# EAGLE design Minimal_carrier_board_for_CM4_rev_E (EAGLE 9.6.2)
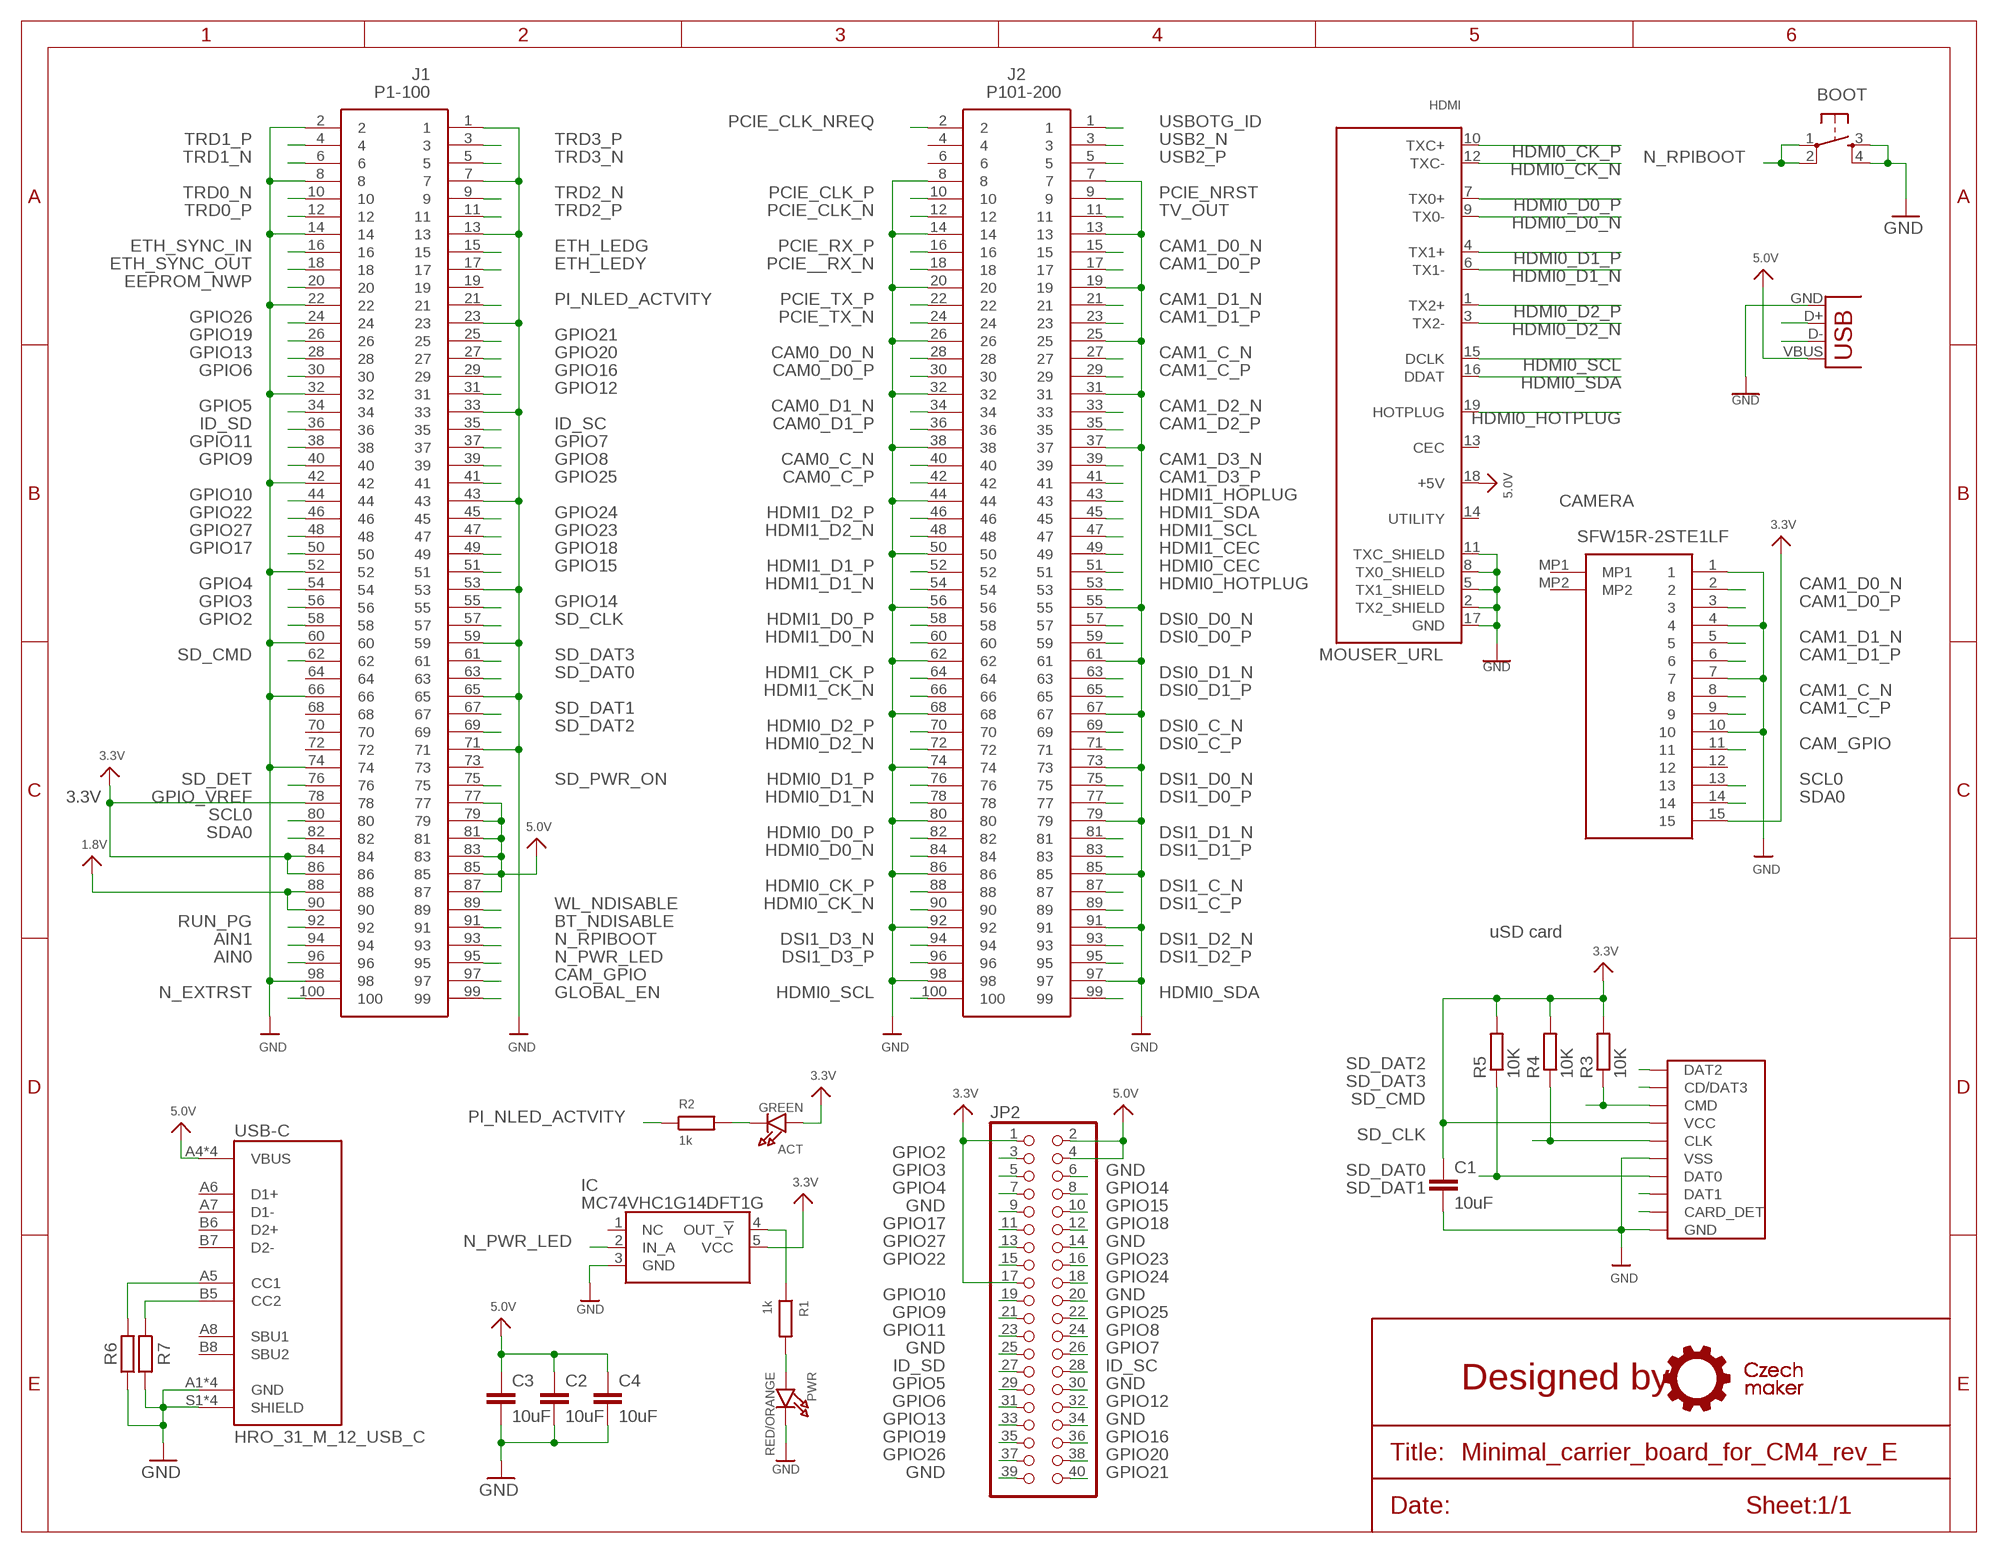
[diagram p0: schematic, sheet 1]

## Parts
ACT  GREEN  LED0805_NOOUTLINE  [CHIPLED_0805_NOOUTLINE]
BOOT  TACTILE_SWITCHE_5X5_MICRO_  [TACTILE_SWITCH_5X5_MICRO]
C1  10uF  C-EUC0805  [C0805]
C2  10uF  C-EUC0805  [C0805]
C3  10uF  C-EUC0805  [C0805]
C4  10uF  C-EUC0805  [C0805]
CAMERA  SFW15R-2STE1LF  [SFW15R2STE1LF]
HDMI  HDMI_MOLEX_47151-0001  [HDMI_MOLEX_47151-0001]
IC  MC74VHC1G14DFT1G  [SOT65P210X110-5N]
J1  P1-100  DF40C-100DS-0.4V_51_  [DF40C100DS04V51]
J2  P101-200  DF40C-100DS-0.4V_51_  [DF40C100DS04V51]
JP2  PINHD-2X20  [2X20]
PWR  RED/ORANGE  LED0805_NOOUTLINE  [CHIPLED_0805_NOOUTLINE]
R1  1k  R-EU_R0805  [R0805]
R2  1k  R-EU_R0805  [R0805]
R3  10K  R-EU_R0805  [R0805]
R4  10K  R-EU_R0805  [R0805]
R5  10K  R-EU_R0805  [R0805]
R6  5.1k  R-EU_R0805  [R0805]
R7  5.1k  R-EU_R0805  [R0805]
SD_CARD  MICRO_SD_CARD_  [TFP09-2--12B]
USB-A  USBA-PTH  [USB-A-F-PTH]
USB-C  HRO_31_M_12_USB_C  [HRO_31_M_12_USB_C]

## Nets
1.8V: J1.88 J1.90
3.3V: ACT.A C1.1 CAMERA.15 IC.5(VCC) J1.78 J1.84 J1.86 JP2.1 JP2.17 R3.2 R4.2 R5.2 SD_CARD.VCC
5.0V: C2.1 C3.1 C4.1 HDMI.18(+5V) J1.77 J1.79 J1.81 J1.83 J1.85 J1.87 JP2.2 JP2.4 USB-A.VBUS USB-C.A4(VBUS) USB-C.A9(VBUS) USB-C.B4(VBUS) USB-C.B9(VBUS)
AIN0: J1.96
AIN1: J1.94
BT_NDISABLE: J1.91
CAM0_C_N: J2.40
CAM0_C_P: J2.42
CAM0_D0_N: J2.28
CAM0_D0_P: J2.30
CAM0_D1_N: J2.34
CAM0_D1_P: J2.36
CAM1_C_N [diff_pairs]: CAMERA.8 J2.27
CAM1_C_P [diff_pairs]: CAMERA.9 J2.29
CAM1_D0_N [diff_pairs]: CAMERA.2 J2.15
CAM1_D0_P [diff_pairs]: CAMERA.3 J2.17
CAM1_D1_N [diff_pairs]: CAMERA.5 J2.21
CAM1_D1_P [diff_pairs]: CAMERA.6 J2.23
CAM1_D2_N [diff_pairs]: J2.33
CAM1_D2_P [diff_pairs]: J2.35
CAM1_D3_N [diff_pairs]: J2.39
CAM1_D3_P [diff_pairs]: J2.41
CAM_GPIO: CAMERA.11 J1.97
DSI0_C_N: J2.69
DSI0_C_P: J2.71
DSI0_D0_N: J2.57
DSI0_D0_P: J2.59
DSI0_D1_N: J2.63
DSI0_D1_P: J2.65
DSI1_C_N [diff_pairs]: J2.87
DSI1_C_P [diff_pairs]: J2.89
DSI1_D0_N [diff_pairs]: J2.75
DSI1_D0_P [diff_pairs]: J2.77
DSI1_D1_N [diff_pairs]: J2.81
DSI1_D1_P [diff_pairs]: J2.83
DSI1_D2_N [diff_pairs]: J2.93
DSI1_D2_P [diff_pairs]: J2.95
DSI1_D3_N [diff_pairs]: J2.94
DSI1_D3_P [diff_pairs]: J2.96
EEPROM_NWP: J1.20
ETH_LEDG: J1.15
ETH_LEDY: J1.17
ETH_SYNC_IN: J1.16
ETH_SYNC_OUT: J1.18
GLOBAL_EN: J1.99
GND: BOOT.3 BOOT.4 C1.2 C2.2 C3.2 C4.2 CAMERA.1 CAMERA.4 CAMERA.7 CAMERA.10 HDMI.2(TX2_SHIELD) HDMI.5(TX1_SHIELD) HDMI.8(TX0_SHIELD) HDMI.11(TXC_SHIELD) HDMI.17(GND) IC.3(GND) J1.1 J1.2 J1.7 J1.8 J1.13 J1.14 J1.22 J1.23 J1.32 J1.33 J1.42 J1.43 J1.52 J1.53 J1.59 J1.60 J1.65 J1.66 J1.71 J1.74 J1.98 J2.7 J2.8 J2.13 J2.14 J2.19 J2.20 J2.25 J2.26 J2.31 J2.32 J2.37 J2.38 J2.44 J2.50 J2.55 J2.56 J2.61 J2.62 J2.67 J2.68 J2.73 J2.74 J2.79 J2.80 J2.85 J2.86 J2.91 J2.92 J2.97 J2.98 JP2.6 JP2.9 JP2.14 JP2.20 JP2.25 JP2.30 JP2.34 JP2.39 PWR.C R6.1 R7.2 SD_CARD.GND SD_CARD.GND@1(GND) SD_CARD.GND@2(GND) SD_CARD.GND@3(VSS) SD_CARD.VSS(GND) USB-A.GND USB-C.A1(GND) USB-C.A12(GND) USB-C.B1(GND) USB-C.B12(GND) USB-C.S1(SHIELD) USB-C.S2(SHIELD) USB-C.S3(SHIELD) USB-C.S4(SHIELD)
GPIO2: J1.58 JP2.3
GPIO3: J1.56 JP2.5
GPIO4: J1.54 JP2.7
GPIO5: J1.34 JP2.29
GPIO6: J1.30 JP2.31
GPIO7: J1.37 JP2.26
GPIO8: J1.39 JP2.24
GPIO9: J1.40 JP2.21
GPIO10: J1.44 JP2.19
GPIO11: J1.38 JP2.23
GPIO12: J1.31 JP2.32
GPIO13: J1.28 JP2.33
GPIO14: J1.55 JP2.8
GPIO15: J1.51 JP2.10
GPIO16: J1.29 JP2.36
GPIO17: J1.50 JP2.11
GPIO18: J1.49 JP2.12
GPIO19: J1.26 JP2.35
GPIO20: J1.27 JP2.38
GPIO21: J1.25 JP2.40
GPIO22: J1.46 JP2.15
GPIO23: J1.47 JP2.16
GPIO24: J1.45 JP2.18
GPIO25: J1.41 JP2.22
GPIO26: J1.24 JP2.37
GPIO27: J1.48 JP2.13
HDMI0_CEC: J2.51
HDMI0_CK_N [diff_pairs]: HDMI.12(TXC-) J2.90
HDMI0_CK_P [diff_pairs]: HDMI.10(TXC+) J2.88
HDMI0_D0_N [diff_pairs]: HDMI.9(TX0-) J2.84
HDMI0_D0_P [diff_pairs]: HDMI.7(TX0+) J2.82
HDMI0_D1_N [diff_pairs]: HDMI.6(TX1-) J2.78
HDMI0_D1_P [diff_pairs]: HDMI.4(TX1+) J2.76
HDMI0_D2_N [diff_pairs]: HDMI.3(TX2-) J2.72
HDMI0_D2_P [diff_pairs]: HDMI.1(TX2+) J2.70
HDMI0_HOTPLUG: HDMI.19(HOTPLUG) J2.53
HDMI0_SCL: HDMI.15(DCLK) J2.100
HDMI0_SDA: HDMI.16(DDAT) J2.99
HDMI1_CEC: J2.49
HDMI1_CK_N: J2.66
HDMI1_CK_P: J2.64
HDMI1_D0_N: J2.60
HDMI1_D0_P: J2.58
HDMI1_D1_N: J2.54
HDMI1_D1_P: J2.52
HDMI1_D2_N: J2.48
HDMI1_D2_P: J2.46
HDMI1_HOPLUG: J2.43
HDMI1_SCL: J2.47
HDMI1_SDA: J2.45
ID_SC: J1.35 JP2.28
ID_SD: J1.36 JP2.27
N$1: ACT.C R2.2
N$8: PWR.A R1.2
N$9: SD_CARD.CD(CARD_DET)
N$14: R6.2 USB-C.A5(CC1)
N$15: R7.1 USB-C.B5(CC2)
N$16: IC.4(OUT_!Y) R1.1
N_EXTRST: J1.100
N_PWR_LED: IC.2(IN_A) J1.95
N_RPIBOOT: BOOT.1 BOOT.2 J1.93
PCIE__RX_N: J2.18
PCIE_CLK_N: J2.12
PCIE_CLK_NREQ: J2.2
PCIE_CLK_P: J2.10
PCIE_NRST: J2.9
PCIE_RX_P: J2.16
PCIE_TX_N: J2.24
PCIE_TX_P: J2.22
PI_NLED_ACTVITY: J1.21 R2.1
RUN_PG: J1.92
SCL0: CAMERA.13 J1.80
SD_CLK: J1.57 R4.1 SD_CARD.CLK
SD_CMD: J1.62 R3.1 SD_CARD.CMD
SD_DAT0: J1.63 R5.1 SD_CARD.DAT0
SD_DAT1: J1.67 SD_CARD.DAT1
SD_DAT2: J1.69 SD_CARD.DAT2
SD_DAT3: J1.61 SD_CARD.CD/DAT3
SD_DET: J1.76
SD_PWR_ON: J1.75
SDA0: CAMERA.14 J1.82
TRD0_N: J1.10
TRD0_P: J1.12
TRD1_N: J1.6
TRD1_P: J1.4
TRD2_N: J1.9
TRD2_P: J1.11
TRD3_N: J1.5
TRD3_P: J1.3
TV_OUT: J2.11
USB2_N [diff_pairs]: J2.3 USB-A.D-
USB2_P [diff_pairs]: J2.5 USB-A.D+
USBOTG_ID: J2.1
WL_NDISABLE: J1.89
Unconnected: CAMERA.12 CAMERA.MP1 CAMERA.MP2 HDMI.13(CEC) HDMI.14(UTILITY) IC.1(NC) J1.19 J1.64 J1.68 J1.70 J1.72 J1.73 J2.4 J2.6 USB-C.A6(D1+) USB-C.A7(D1-) USB-C.A8(SBU1) USB-C.B6(D2+) USB-C.B7(D2-) USB-C.B8(SBU2)

## Notes on the sheet
- GPIO_VREF
- uSD card

## Power pins joined to a net without a drawn wire
GND: HDMI.P$1(GND) HDMI.P$2(GND) HDMI.P$3(GND) HDMI.P$4(GND)

## Library data of the parts
ACT PWR = dronecz:LED: LED 0603 - 0603 Surface Mount Package 2mA: Green LED - Low Power (3.9mcd, 2ma, 1.7Vf) - Digikey: 475-2709-2-ND Orange LED - Low Power (9.8mcd, 2ma, 1.8Vf) - Digikey: 475-1194-2-ND Red LED - Low Power (5mcd, 2ma, 1.8Vf) - Digikey: 475-1195-2-ND Yellow LED - Low Power (7mcd, 2ma, 1.8Vf) - Digikey: 475-1196-2-ND 5mA: Blue LED - Low Power (17mcd, 5ma, 2.9Vf) - Digikey: LNJ937W8CRACT-ND 0805 - 0805 Surface Mount Package 2mA: Red LED (8.8mcd, 2mA, 1.8Vf, Clear) - Low Power [Digikey: 475-2510-1-ND] Green LED (5mcd, 2mA, 1.8Vf, Clear) - Low Power [Digikey: 475-2730-1-ND] Yellow LED (11.3mcd, 2mA, 1.8Vf, Clear) - Low Power [Digikey: 475-2555-1-ND] 20mA: Red LED (104mcd, 20mA, Diffused) - LS R976 [Digikey: 475-1278-6-ND] Red LED (12mcd, 20mA, 2.0Vf, Clear) - APT2012EC [Digikey: 754-1128-1-ND] Green LED (15mcd, 20mA, 2.2Vf, Clear) - APT2012GC [Digikey: 754-1131-1-ND] Orange LED (160mcd, 20mA, 2.1Vf, Clear) - APT2012SECK [Digikey: 754-1130-1-ND] 1206 - 1206 Surface Mount Package Green LED (26mcd, 20mA, Diffused) - LG N971 [Digikey: 475-1407-6-ND] Red LED (15mcd, 20mA, Diffused) - LH N974 [Digikey: 475-1416-6-ND]
BOOT = dronecz:TACTILE_SWITCHE_5X5_MICRO
C1-C4 = rcl:C-EU: CAPACITOR, European symbol; SPICEPREFIX: C
CAMERA = dronecz:SFW15R-2STE1LF: FFC & FPC Connectors 15P SIDE SMT ZIF UPPER CONTACT Source: Datasheet <https://cdn.amphenol-icc.com/media/wysiwyg/files/drawing/sfw12lf.pdf>; DESCRIPTION: FFC & FPC Connectors 15P SIDE SMT ZIF UPPER CONTACT; HEIGHT: 2.7mm; MANUFACTURER_NAME: Amphenol; MANUFACTURER_PART_NUMBER: SFW15R-2STE1LF; MOUSER_PART_NUMBER: 649-SFW15R-2STE1LF; MOUSER_PRICE-STOCK: https://www.mouser.co.uk/ProductDetail/Amphenol-FCI/SFW15R-2STE1LF/?qs=XRaITl65jnu3B148xsdn9A%3D%3D
HDMI = dronecz:HDMI_MOLEX_47151-0001; MOUSER_URL: https://cz.mouser.com/ProductDetail/Molex/47151-1081?qs=rg3U%2F5nEhHf8zd%2FI8aNW2A%3D%3D
IC = dronecz:MC74VHC1G14DFT1G: Source: Datasheet <http://www.onsemi.com/pub/Collateral/MC74VHC1G14-D.PDF>; HEIGHT: 1.1mm; MANUFACTURER_NAME: ON Semiconductor; MANUFACTURER_PART_NUMBER: MC74VHC1G14DFT1G; MOUSER_PART_NUMBER: 863-MC74VHC1G14DFT1G; MOUSER_PRICE-STOCK: https://www.mouser.co.uk/ProductDetail/ON-Semiconductor/MC74VHC1G14DFT1G?qs=YOLdObVcOZkl2BbCxsVnXA%3D%3D
J1 J2 = dronecz:DF40C-100DS-0.4V_51_: HIROSE(HRS) - DF40C-100DS-0.4V(51) - CONNECTOR, STACKING, RCPT, 100POS, 2ROW Source: Datasheet <https://www.hirose.com/product/en/download_file/key_name/DF40C-100DS-0.4V(51)/category/Drawing (2D)/doc_file_id/46856/?file_category_id=6&item_id=06844033451&is_series=>; DESCRIPTION: HIROSE(HRS) - DF40C-100DS-0.4V(51) - CONNECTOR, STACKING, RCPT, 100POS, 2ROW; HEIGHT: 1.65mm; MANUFACTURER_NAME: Hirose; MANUFACTURER_PART_NUMBER: DF40C-100DS-0.4V(51); MOUSER_PART_NUMBER: 798-DF40C100DS0.4V51; MOUSER_PRICE-STOCK: https://www.mouser.co.uk/ProductDetail/Hirose-Connector/DF40C-100DS-04V51?qs=eDUdFcBPps2MEwbnuPvZzQ%3D%3D
JP2 = pinhead:PINHD-2X20: PIN HEADER
R1-R7 = rcl:R-EU_: RESISTOR, European symbol; SPICEPREFIX: R
SD_CARD = dronecz:MICRO_SD_CARD
USB-A = Ai_Connectors:USB
USB-C = dronecz:HRO_31_M_12_USB_C: USB Shielded I/O Receptacle; Type C; Right Angle; Surface Mount; Gold over Nickel

## Net classes
1 diff_pairs: width 0.152 mm

## Board
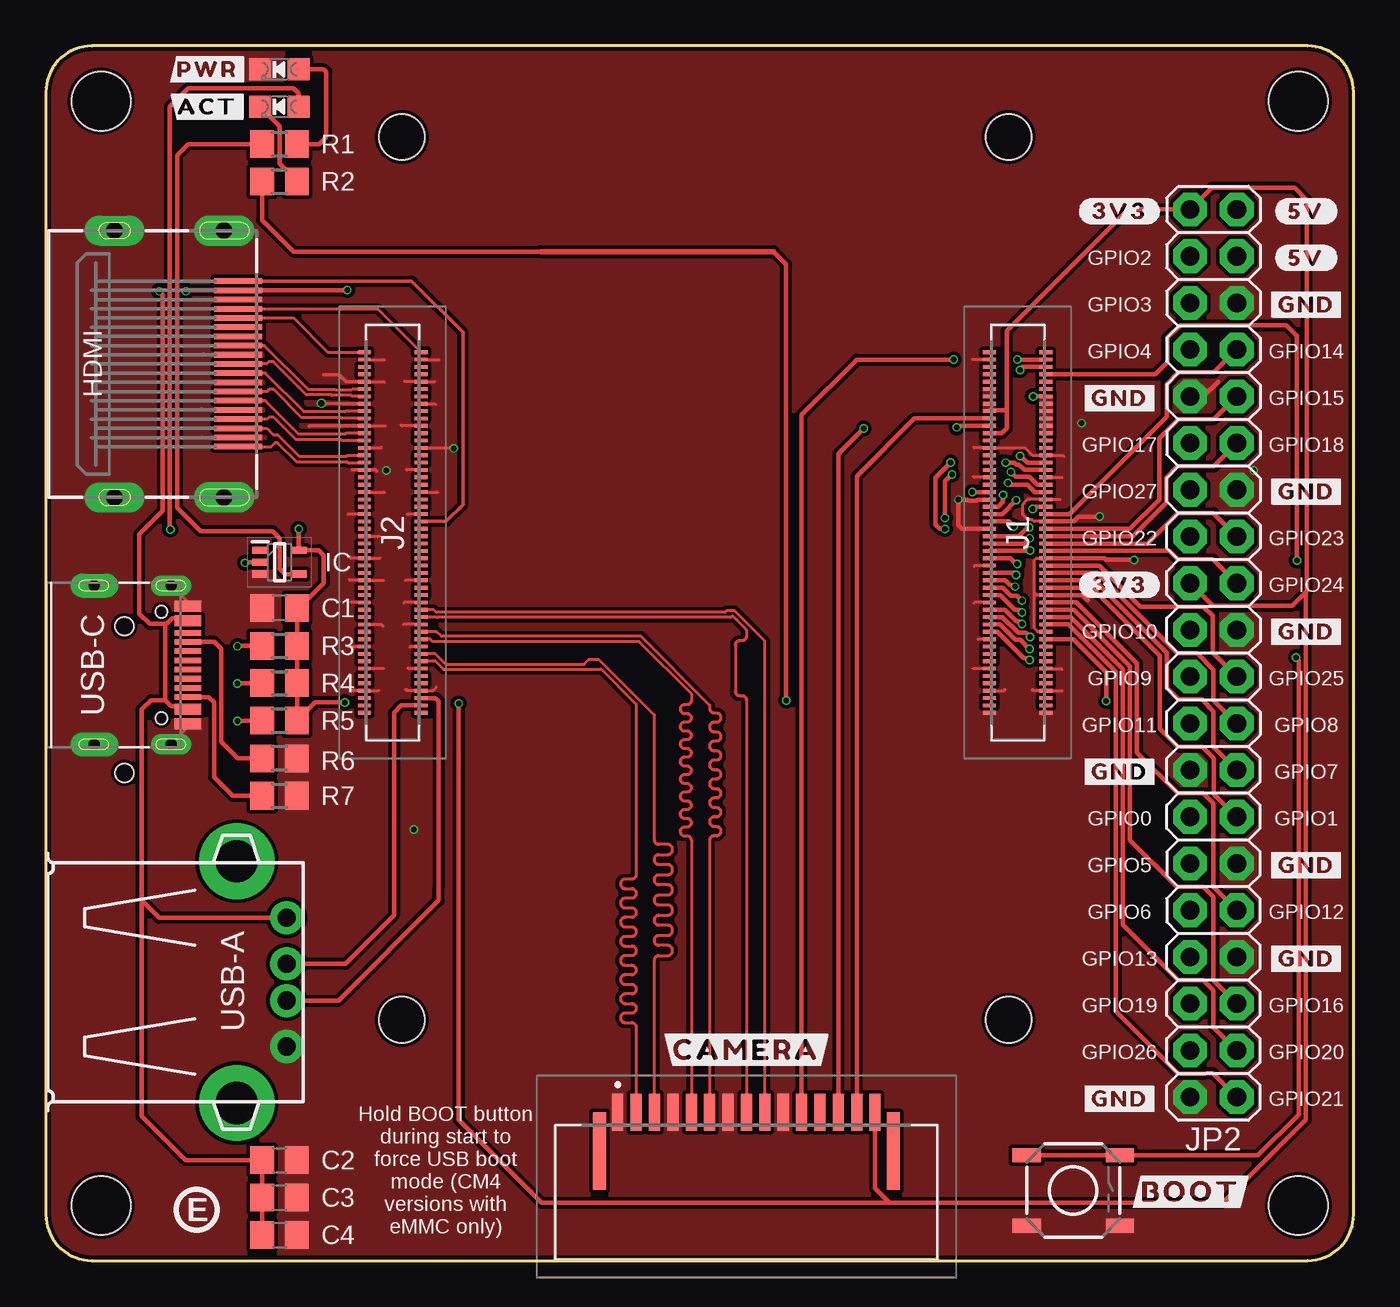
[diagram p1: board, top side]
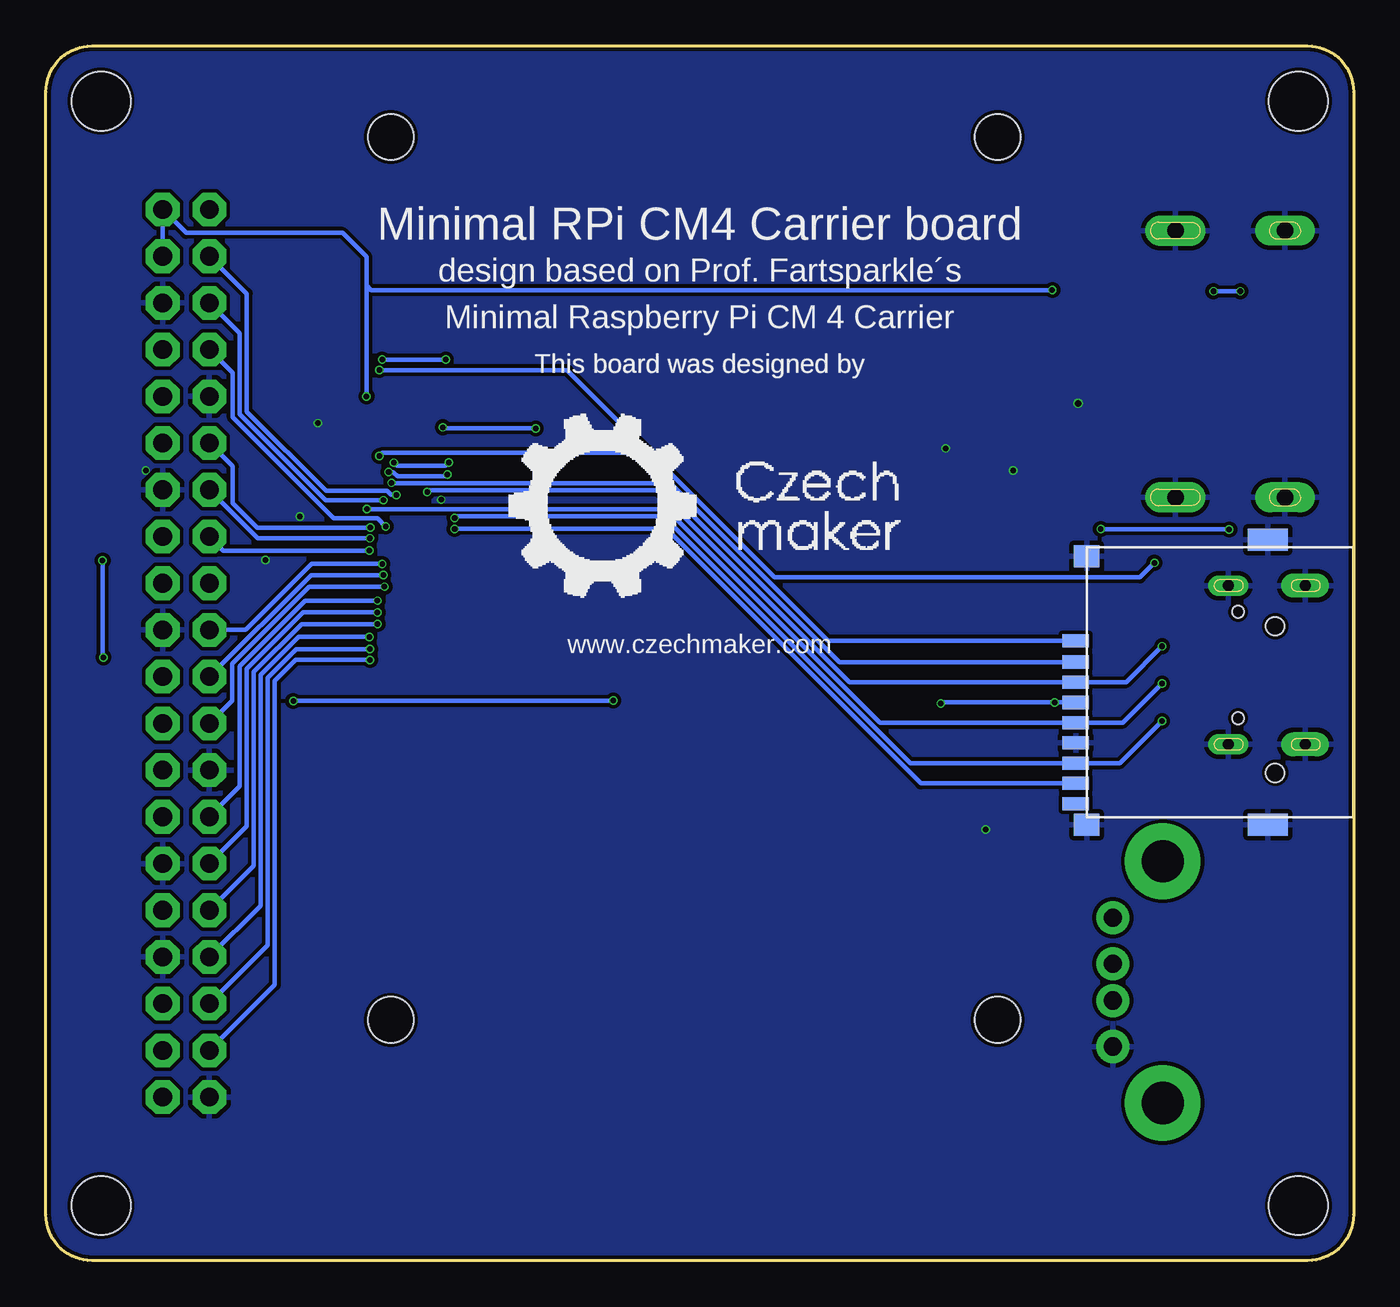
[diagram p2: board, bottom side, seen from below]

Size 71.12 x 66.04 mm. Coordinates in mm from the lower left corner, seen from the top.
Outline: 68.62,66.04 2.5,66.04 arc90 0,63.54 0,2.5 arc90 2.5,0 68.62,0 arc90 71.12,2.5 71.12,63.54 arc90 68.62,66.04
Copper layers (1*16): Top 0.035mm / dielectric 1.6mm / Bottom 0.035mm
Design rules "jlcpcb2layer": minimum track width 5mil, minimum drill 0.3mm, track to track 5mil, track to pad 5mil, pad to pad 5mil, via to via 5mil, smd to smd 5mil, copper to edge 0.2mm, drill to drill 6mil, minimum pad ring 10mil, minimum via ring 3mil, stop-mask expansion 4mil, vias tented up to drill 0mil, thermal gap 10mil
Holes 2.5 mm at 19.36,61.09 52.36,61.09 19.36,13.09 52.36,13.09
Holes 3.2 mm at 3,3 3,63.04 68.12,63.04 68.12,3

### Footprints (pad centres in the part's own frame; a part is rotated, then mirrored left to right if it is on the bottom)
CHIPLED_0805_NOOUTLINE = smd 1.2 x 1.2: A 0,-1.05; C 0,1.05
TACTILE_SWITCH_5X5_MICRO = smd 1.524 x 0.762: 1 -2.54,1.905; 2 2.54,1.905; 3 -2.54,-1.905; 4 2.54,-1.905
C0805 = smd 1.3 x 1.5: 1 -0.95,0; 2 0.95,0
SFW15R2STE1LF = smd 0.6 x 2: 1 -7,4; 2 -6,4; 3 -5,4; 4 -4,4; 5 -3,4; 6 -2,4; 7 -1,4; 8 0,4; 9 1,4; 10 2,4; 11 3,4; 12 4,4; 13 5,4; 14 6,4; 15 7,4 | smd 0.7 x 4.2: MP1 -8,1.9; MP2 8,1.9
HDMI_MOLEX_47151-0001 = smd 0.3 x 2.6: 1 4.5,0; 2 4,0; 3 3.5,0; 4 3,0; 5 2.5,0; 6 2,0; 7 1.5,0; 8 1,0; 9 0.5,0; 10 0,0; 11 -0.5,0; 12 -1,0; 13 -1.5,0; 14 -2,0; 15 -2.5,0; 16 -3,0; 17 -3.5,0; 18 -4,0; 19 -4.5,0 | drill 0.9 pad 1.65 long: P$1 -7.25,-0.76; P$2 7.25,-0.76 | drill 0.9 pad 1.5 long: P$3 7.25,-6.72; P$4 -7.25,-6.72
SOT65P210X110-5N = smd 0.85 x 0.4: 1 -1.05,0.65; 2 -1.05,0; 3 -1.05,-0.65; 4 1.05,-0.65; 5 1.05,0.65
DF40C100DS04V51 = smd 0.2 x 0.7: 1 -9.8,-1.54; 2 -9.8,1.54; 3 -9.4,-1.54; 4 -9.4,1.54; 5 -9,-1.54; 6 -9,1.54; 7 -8.6,-1.54; 8 -8.6,1.54; 9 -8.2,-1.54; 10 -8.2,1.54; 11 -7.8,-1.54; 12 -7.8,1.54; 13 -7.4,-1.54; 14 -7.4,1.54; 15 -7,-1.54; 16 -7,1.54; 17 -6.6,-1.54; 18 -6.6,1.54; 19 -6.2,-1.54; 20 -6.2,1.54; 21 -5.8,-1.54; 22 -5.8,1.54; 23 -5.4,-1.54; 24 -5.4,1.54; 25 -5,-1.54; 26 -5,1.54; 27 -4.6,-1.54; 28 -4.6,1.54; 29 -4.2,-1.54; 30 -4.2,1.54; 31 -3.8,-1.54; 32 -3.8,1.54; 33 -3.4,-1.54; 34 -3.4,1.54; 35 -3,-1.54; 36 -3,1.54; 37 -2.6,-1.54; 38 -2.6,1.54; 39 -2.2,-1.54; 40 -2.2,1.54; 41 -1.8,-1.54; 42 -1.8,1.54; 43 -1.4,-1.54; 44 -1.4,1.54; 45 -1,-1.54; 46 -1,1.54; 47 -0.6,-1.54; 48 -0.6,1.54; 49 -0.2,-1.54; 50 -0.2,1.54; 51 0.2,-1.54; 52 0.2,1.54; 53 0.6,-1.54; 54 0.6,1.54; 55 1,-1.54; 56 1,1.54; 57 1.4,-1.54; 58 1.4,1.54; 59 1.8,-1.54; 60 1.8,1.54; 61 2.2,-1.54; 62 2.2,1.54; 63 2.6,-1.54; 64 2.6,1.54; 65 3,-1.54; 66 3,1.54; 67 3.4,-1.54; 68 3.4,1.54; 69 3.8,-1.54; 70 3.8,1.54; 71 4.2,-1.54; 72 4.2,1.54; 73 4.6,-1.54; 74 4.6,1.54; 75 5,-1.54; 76 5,1.54; 77 5.4,-1.54; 78 5.4,1.54; 79 5.8,-1.54; 80 5.8,1.54; 81 6.2,-1.54; 82 6.2,1.54; 83 6.6,-1.54; 84 6.6,1.54; 85 7,-1.54; 86 7,1.54; 87 7.4,-1.54; 88 7.4,1.54; 89 7.8,-1.54; 90 7.8,1.54; 91 8.2,-1.54; 92 8.2,1.54; 93 8.6,-1.54; 94 8.6,1.54; 95 9,-1.54; 96 9,1.54; 97 9.4,-1.54; 98 9.4,1.54; 99 9.8,-1.54; 100 9.8,1.54
2X20 = drill 1.016 octagon: 1 -24.13,-1.27; 2 -24.13,1.27; 3 -21.59,-1.27; 4 -21.59,1.27; 5 -19.05,-1.27; 6 -19.05,1.27; 7 -16.51,-1.27; 8 -16.51,1.27; 9 -13.97,-1.27; 10 -13.97,1.27; 11 -11.43,-1.27; 12 -11.43,1.27; 13 -8.89,-1.27; 14 -8.89,1.27; 15 -6.35,-1.27; 16 -6.35,1.27; 17 -3.81,-1.27; 18 -3.81,1.27; 19 -1.27,-1.27; 20 -1.27,1.27; 21 1.27,-1.27; 22 1.27,1.27; 23 3.81,-1.27; 24 3.81,1.27; 25 6.35,-1.27; 26 6.35,1.27; 27 8.89,-1.27; 28 8.89,1.27; 29 11.43,-1.27; 30 11.43,1.27; 31 13.97,-1.27; 32 13.97,1.27; 33 16.51,-1.27; 34 16.51,1.27; 35 19.05,-1.27; 36 19.05,1.27; 37 21.59,-1.27; 38 21.59,1.27; 39 24.13,-1.27; 40 24.13,1.27
R0805 = smd 1.3 x 1.5: 1 -0.95,0; 2 0.95,0
TFP09-2--12B = smd 0.711 x 1.422: CD -6.6,7.85; CD/DAT3 1.1,7.85; CLK -2.2,7.85; CMD 0,7.85; DAT0 -4.4,7.85; DAT1 -5.5,7.85; DAT2 2.25,7.85; VCC -1.1,7.85; VSS -3.3,7.85 | smd 1.2 x 2.2: GND -7.75,-2.6; GND@1 7.75,-2.6 | smd 1.2 x 1.4: GND@2 -7.75,7.25; GND@3 6.85,7.25 | hole 1: -4.93,-3; 3.05,-3
USB-A-F-PTH = drill 1: D+ 1,5.37; D- -1,5.37; GND 3.5,5.37; VBUS -3.5,5.37 | drill 2.286: P$1 -6.57,2.66; P$2 6.57,2.66
HRO_31_M_12_USB_C = smd 0.3 x 1.45: A1 -3.35,4.045; A4 -2.55,4.045; A5 -1.25,4.045; A6 -0.25,4.045; A7 0.25,4.045; A8 1.25,4.045; A9 2.55,4.045; A12 3.35,4.045; B1 3.05,4.045; B4 2.25,4.045; B5 1.75,4.045; B6 0.75,4.045; B7 -0.75,4.045; B8 -1.75,4.045; B9 -2.25,4.045; B12 -3.05,4.045 | drill 0.6 pad 1.1 long: S1 -4.32,3.13; S2 4.32,3.13 | drill 0.6 pad 1.3 long: S3 -4.32,-1.05; S4 4.32,-1.05 | hole 0.65: -2.89,2.6; 2.89,2.6

### Placement (x,y rotation side)
ACT  12.7,62.74 90 top
BOOT  55.88,3.81 0 top
C1  12.7,35.48 180 top
C2  12.7,5.46 0 top
C3  12.7,3.43 0 top
C4  12.7,1.4 0 top
CAMERA  38.1,4.06 0 top
HDMI  10.45,48.75 270 top
IC  12.7,37.97 0 top
J1  52.86,39.59 90 top
J2  18.86,39.59 90 top
JP2  63.5,33.02 270 top
PWR  12.7,64.77 90 top
R1  12.7,60.71 0 top
R2  12.7,58.67 0 top
R3  12.7,33.43 0 top
R4  12.7,31.39 0 top
R5  12.7,29.36 0 top
R6  12.7,27.3 180 top
R7  12.7,25.27 0 top
SD_CARD  7.26,31.45 90 bottom
U$6  [#GND#0]  68.55,51.97 0 top
U$7  [#GND#0]  58.39,46.89 0 top
U$8  [#GND#0]  68.55,41.81 0 top
U$9  [#GND#0]  68.55,34.19 0 top
U$10  [#GND#0]  58.39,26.57 0 top
U$11  [#GND#0]  68.55,21.49 0 top
U$12  [#GND#0]  68.55,16.41 0 top
U$13  [#GND#0]  58.39,8.79 0 top
U$14  [#5V#0]  68.55,57.05 0 top
U$15  [#5V#0]  68.55,54.51 0 top
U$16  [#3V3#0]  58.39,57.05 0 top
U$17  [#3V3#0]  58.39,36.73 0 top
U$18  [#PWR#0]  8.76,64.77 0 top
U$19  [#ACT#0]  8.76,62.74 0 top
U$20  [#CAMERA#0]  38.1,11.46 0 top
U$21  [#BOOT#0]  62.26,3.75 0 top
USB-A  7.72,15.14 270 top
USB-C  3.68,32.38 270 top

### Tracks (layer width: path | path; a pad name or v marks a point on that pad's centre or on a via)
1.8V
  pour Top (no thermals): 50.99,46.93 50.99,47.47 51.63,47.47 51.63,46.93
3.3V  (via drill 0.3)
  Top 0.152: J1.84 51.36,46.23
  Top 0.254: ACT.A 13.75,63.47 13.46,63.75 7.75,63.75 6.73,62.74 6.73,39.78 v6.76,39.75 | v16.26,30.35 14.64,30.35 R5.2 R4.2 R3.2 C1.1 13.77,35.48 15.11,36.83 15.11,38.35 14.84,38.62 IC.5 v13.75,39.78 | 52.26,46.23 52.26,50.55 58.86,57.15 JP2.1 63.41,58.32 67.91,58.32 68.58,57.66 68.58,36.38 68.53,36.34 | JP2.17 63.47,35.59 67.79,35.59 68.53,36.34 | CAMERA.15 45.1,3.92 45.88,3.14 | 45.88,3.14 64.01,3.14 68.53,7.67 68.53,36.34 | v22.45,30.29 22.45,7.65 26.96,3.14 45.88,3.14 | J1.78 52,44.99 52.26,45.24 52.26,46.23 | 51.36,46.23 52.26,46.23
  Bottom 0.254: SD_CARD.VCC 15.12,30.35 v16.26,30.35 22.38,30.35 v22.45,30.29 | v6.76,39.75 13.72,39.75 v13.75,39.78
  pour Top (no thermals): 50.99,46.13 50.99,46.64 51.63,46.64 51.63,46.13
5.0V  (via drill 0.3)
  Top 0.152: USB-C.B9 USB-C.A4 | USB-C.A9 USB-C.B4
  Top 0.254: v7.62,52.7 7.67,52.75 HDMI.18 16.37,52.75 v16.38,52.77 | v6.16,52.7 6.35,52.52 6.35,40.77 5.08,39.5 5.08,35.18 5.64,34.62 6.48,34.62 | USB-C.A4 6.87,34.94 6.55,34.62 6.48,34.62 | USB-C.B4 6.82,30.14 6.48,30.48 | 6.48,30.48 6.48,34.62 | USB-A.VBUS 6.16,18.64 5.21,19.59 | 6.48,30.48 5.71,30.48 5.21,29.97 5.21,19.59 | J1.87 v53.69,46.99 | C4.1 C3.1 C2.1 7.59,5.46 5.21,7.84 5.21,19.59
  Bottom 0.254: v7.62,52.7 v6.16,52.7 | v53.69,46.99 53.69,53.02 | 53.69,53.02 53.69,54.58 54.99,55.88 63.5,55.88 JP2.2 JP2.4 | v16.38,52.77 53.44,52.77 53.69,53.02
  pour Top (no thermals): 54.07,47.05 54.07,44.93 54.74,44.93 54.74,47.05
CAM1_C_N
  Top 0.152: CAMERA.8 38.1,30.48 arc90 37.87,30.71 37.73,30.71 arc-90 37.49,30.95 37.49,33.47 arc-90 37.73,33.7 37.87,33.7 arc90 38.1,33.94 38.1,34.29 37.34,35.05 37.26,34.97 21.3,34.97 20.42,34.97 J2.27
CAM1_C_P
  Top 0.152: CAMERA.9 39.1,33.69 37.45,35.33 37.01,35.33 36.93,35.25 21.23,35.25 21.09,35.39 J2.29
CAM1_D0_N
  Top 0.152: CAMERA.2 32.1,12.7 arc90 31.86,12.94 31.5,12.94 arc-90 31.26,13.17 31.26,13.22 arc-90 31.5,13.46 31.86,13.46 arc90 32.1,13.69 32.1,13.74 arc90 31.86,13.98 31.5,13.98 arc-90 31.26,14.21 31.26,14.26 arc-90 31.5,14.5 31.86,14.5 arc90 32.1,14.73 32.1,14.78 arc90 31.86,15.02 31.5,15.02 arc-90 31.26,15.25 31.26,15.3 arc-90 31.5,15.54 31.86,15.54 arc90 32.1,15.77 32.1,15.82 arc90 31.86,16.06 31.5,16.06 arc-90 31.26,16.29 31.26,16.34 arc-90 31.5,16.58 31.86,16.58 arc90 32.1,16.81 32.1,16.86 arc90 31.86,17.1 31.5,17.1 arc-90 31.26,17.33 31.26,17.39 arc-90 31.5,17.62 31.86,17.62 arc90 32.1,17.86 32.1,17.91 arc90 31.86,18.14 31.5,18.14 arc-90 31.26,18.38 31.26,18.43 arc-90 31.5,18.66 31.86,18.66 arc90 32.1,18.9 32.1,18.95 arc90 31.86,19.18 31.5,19.18 arc-90 31.26,19.42 31.26,19.47 arc-90 31.5,19.7 31.86,19.7 arc90 32.1,19.94 32.1,19.99 arc90 31.86,20.22 31.5,20.22 arc-90 31.26,20.46 31.26,20.51 arc-90 31.5,20.74 31.86,20.74 arc90 32.1,20.98 32.1,30.26 30.19,32.17 30.18,32.16 30.16,32.14 21.62,32.14 21.16,32.6 21.13,32.6 21.12,32.59 J2.15
CAM1_D0_P
  Top 0.152: CAMERA.3 33.1,16.35 arc-90 33.34,16.58 33.84,16.58 arc90 34.07,16.82 34.07,16.9 arc90 33.84,17.13 33.34,17.13 arc-90 33.1,17.37 33.1,17.45 arc-90 33.34,17.68 33.84,17.68 arc90 34.07,17.92 34.07,18 arc90 33.84,18.23 33.34,18.23 arc-90 33.1,18.47 33.1,18.55 arc-90 33.34,18.78 33.84,18.78 arc90 34.07,19.02 34.07,19.09 arc90 33.84,19.33 33.34,19.33 arc-90 33.1,19.57 33.1,19.64 arc-90 33.34,19.88 33.84,19.88 arc90 34.07,20.11 34.07,20.19 arc90 33.84,20.43 33.34,20.43 arc-90 33.1,20.66 33.1,20.74 arc-90 33.34,20.98 33.84,20.98 arc90 34.07,21.21 34.07,21.29 arc90 33.84,21.53 33.34,21.53 arc-90 33.1,21.76 33.1,21.84 arc-90 33.34,22.08 33.84,22.08 arc90 34.07,22.31 34.07,22.39 arc90 33.84,22.62 33.34,22.62 arc-90 33.1,22.86 33.1,29.65 30.09,32.66 29.51,32.66 29.27,32.42 21.74,32.42 21.18,32.99 J2.17
CAM1_D1_N
  Top 0.152: CAMERA.5 35.1,22.86 arc90 34.87,23.09 34.73,23.09 arc-90 34.5,23.33 34.5,23.34 arc-90 34.73,23.57 34.87,23.57 arc90 35.1,23.8 35.1,23.81 arc90 34.87,24.05 34.73,24.05 arc-90 34.5,24.28 34.5,24.29 arc-90 34.73,24.52 34.87,24.52 arc90 35.1,24.76 35.1,24.76 arc90 34.87,25 34.73,25 arc-90 34.5,25.23 34.5,25.24 arc-90 34.73,25.47 34.87,25.47 arc90 35.1,25.71 35.1,25.71 arc90 34.87,25.95 34.73,25.95 arc-90 34.5,26.18 34.5,26.19 arc-90 34.73,26.42 34.87,26.42 arc90 35.1,26.66 35.1,26.66 arc90 34.87,26.9 34.73,26.9 arc-90 34.5,27.13 34.5,27.14 arc-90 34.73,27.37 34.87,27.37 arc90 35.1,27.61 35.1,27.61 arc90 34.87,27.85 34.73,27.85 arc-90 34.5,28.08 34.5,28.09 arc-90 34.73,28.32 34.87,28.32 arc90 35.1,28.56 35.1,28.56 arc90 34.87,28.8 34.73,28.8 arc-90 34.5,29.03 34.5,29.04 arc-90 34.73,29.27 34.87,29.27 arc90 35.1,29.51 35.1,29.51 arc90 34.87,29.75 34.73,29.75 arc-90 34.5,29.98 34.5,29.99 arc-90 34.73,30.22 34.87,30.22 arc90 35.1,30.46 35.1,30.81 32.26,33.66 21.03,33.66 20.9,33.79 J2.21
CAM1_D1_P
  Top 0.152: CAMERA.6 36.1,22.86 arc-90 36.34,23.09 36.47,23.09 arc90 36.7,23.33 36.7,23.37 arc90 36.47,23.61 36.34,23.61 arc-90 36.1,23.84 36.1,23.89 arc-90 36.34,24.12 36.47,24.12 arc90 36.7,24.36 36.7,24.4 arc90 36.47,24.64 36.34,24.64 arc-90 36.1,24.87 36.1,24.92 arc-90 36.34,25.15 36.47,25.15 arc90 36.7,25.39 36.7,25.43 arc90 36.47,25.67 36.34,25.67 arc-90 36.1,25.9 36.1,25.95 arc-90 36.34,26.18 36.47,26.18 arc90 36.7,26.42 36.7,26.46 arc90 36.47,26.7 36.34,26.7 arc-90 36.1,26.93 36.1,26.98 arc-90 36.34,27.21 36.47,27.21 arc90 36.7,27.45 36.7,27.49 arc90 36.47,27.72 36.34,27.72 arc-90 36.1,27.96 36.1,28 arc-90 36.34,28.24 36.47,28.24 arc90 36.7,28.47 36.7,28.52 arc90 36.47,28.75 36.34,28.75 arc-90 36.1,28.99 36.1,29.03 arc-90 36.34,29.27 36.47,29.27 arc90 36.7,29.5 36.7,29.55 arc90 36.47,29.78 36.34,29.78 arc-90 36.1,30.02 36.1,30.21 32.37,33.93 21.51,33.93 21.26,34.19 J2.23
CAM_GPIO  (via drill 0.3)
  Top 0.254: CAMERA.11 41.1,45.99 44.1,48.99 v49.37,48.99 | v52.83,48.99 J1.97
  Bottom 0.254: v49.37,48.99 v52.83,48.99
GND  (via drill 0.3, 0.35)
  Top 0.152: J2.92 18.38,47.79 18.41,47.75 | 21.14,47.78 21.14,47.79 J2.91 19.52,47.79 19.49,47.82 | J2.80 18.43,45.39 18.45,45.37 | J2.74 18.21,44.19 18.26,44.23 | J2.62 18.38,41.79 18.41,41.75 | J2.56 17.3,40.58 16.41,40.58 | J2.50 18.11,39.39 18.13,39.37 | 18.35,36.99 J2.38 16.54,36.99 16.51,37.02 | J2.32 16.63,35.79 16.61,35.81 | J2.26 18.25,34.59 18.32,34.51 | J2.20 16.43,33.39 16.41,33.4 | J2.14 18.38,32.2 | 16.61,30.99 J2.8 18.1,30.99 | 21.24,31.18 21.05,30.99 J2.7 19.62,30.99 19.56,31.05 | J2.13 19.72,32.19 19.68,32.23 | J2.19 19.8,33.39 19.78,33.37 | J2.25 19.44,34.59 19.43,34.58 | J2.31 19.5,35.79 19.46,35.75 | J2.37 19.56,36.99 | J2.55 19.66,40.59 19.65,40.58 | J2.61 21.27,41.79 21.3,41.75 | J2.67 19.62,42.99 19.59,43.02 | J2.73 22.17,44.19 v22.19,44.16 | J2.79 19.35,45.39 19.3,45.43 | J2.85 21.17,46.59 21.21,46.54 | J2.97 21.34,48.99 21.37,48.96 | J2.86 15.01,46.59 v14.99,46.61 | J2.98 18.39,48.99 18.41,48.96 | USB-C.S2 6.81,28.12 USB-C.A12 | USB-C.S1 7.73,35.79 USB-C.A1 | J1.8 52.1,30.99 52.16,31.05 | J1.14 50.43,32.19 50.42,32.2 | J1.22 50.71,33.79 50.7,33.78 | J1.32 50.52,35.79 50.48,35.75 | J1.42 50.52,37.79 50.48,37.75 | 50.45,44.23 50.49,44.19 J1.74 53.25,44.19 53.66,43.78 J1.71 55.3,43.79 55.37,43.72 | J1.65 55.27,42.59 55.28,42.58 | J1.33 53.89,36.19 53.77,36.31 | 53.77,36.31 53.75,36.32 53.75,38.07 53.88,38.2 54.39,38.2 J1.43 | J1.23 53.95,34.19 53.77,34.37 53.77,36.31 | J1.13 55.22,32.19 55.28,32.13 | 53.63,31.05 53.69,30.99 J1.7 55.25,30.99 55.28,30.96 | J1.66 50.47,42.59 50.42,42.64 | J1.53 53.75,40.19 53.65,40.29 53.4,40.29 53.12,40.58 53.12,41.08 53.2,41.16 53.2,41.21 53.37,41.39 J1.59 55.13,41.39 55.15,41.37
  Top 0.152: J1.98 50.39,48.99 | HDMI.2 8.49,44.75 8.48,44.77 | HDMI.5 8.52,46.25 8.45,46.32 | HDMI.8 8.48,47.75 8.45,47.78 | HDMI.11 8.63,49.25 8.57,49.31 | HDMI.17 8.61,52.25 8.57,52.29 | 16.51,38.26 16.58,38.19 J2.44 18.16,38.2
  Top 0.203: 17.98,42.93 17.92,42.99 J2.68 16.65,42.99 | J2.80 14.35,45.39 14.33,45.36 | J2.86 16.15,46.59 | J2.92 16.32,47.79 15.95,48.16 15.11,48.16
  Top 0.254: J1.53 55.9,40.19 56.17,40.45 v57.31,40.45 | J1.43 57.57,38.19 57.66,38.1 v59.18,38.1 | J1.33 56.4,36.19 56.67,35.91 | J1.60 51.3,41.37 50.65,41.37 50.59,41.3 50.19,41.3 50.12,41.37 | 50.12,41.37 v49.62,41.37 49.62,39.97 49.81,39.79 J1.52 | 50.09,41.34 50.12,41.37 | JP2.9 62.96,46.99 63.75,47.78
  other vias: 20,23.43 18.51,42.96 56.32,45.53 65.69,42.96
  pour Top (isolate 0.203, rank 2, no thermals): -1.92,67.86 73.44,67.86 73.44,-1.69 -1.92,-1.69
  pour Bottom (isolate 0.203, rank 2): -4.21,70.4 74.58,70.4 74.58,-2.58 -4.21,-2.58
GPIO2  (via drill 0.3)
  Top 0.254: J1.58 51.8,40.99 52.06,41.25 v52.06,41.63
  Bottom 0.254: v52.06,41.63 52.34,41.63 52.56,41.85 55.88,41.85 60.2,46.16 60.2,52.58 JP2.3
GPIO3  (via drill 0.3)
  Top 0.254: J1.56 52.01,40.59 v52.77,41.34
  Bottom 0.254: v52.77,41.34 55.92,41.34 60.58,46 60.58,50.42 JP2.5
GPIO4  (via drill 0.3)
  Top 0.254: J1.54 52.36,40.19 v52.64,39.91
  Bottom 0.254: v52.64,39.91 53.09,40.35 55.47,40.35 60.96,45.85 60.96,48.26 JP2.7
GPIO5  (via drill 0.3)
  Top 0.254: J1.34 51.91,36.19 52.7,35.4 52.93,35.4 v53.09,35.24
  Bottom 0.254: v53.09,35.24 57.12,35.24 60.2,32.17 60.2,23.62 JP2.29
GPIO6  (via drill 0.3)
  Top 0.254: J1.30 52.17,35.39 52.8,34.76 52.93,34.76 v53.09,34.61
  Bottom 0.254: v53.09,34.61 57.22,34.61 59.82,32.01 59.82,21.46 JP2.31
GPIO7
  Top 0.254: J1.37 57.03,36.99 60.96,33.05 60.96,31.15 61.59,30.51 62.87,30.51 63.5,29.88 63.5,27.94 JP2.26
GPIO8
  Top 0.254: J1.39 57.16,37.39 61.53,33.02 62.61,33.02 63.5,32.13 63.5,30.48 JP2.24
GPIO9  (via drill 0.3)
  Top 0.254: J1.40 52.66,37.39 v52.77,37.27
  Bottom 0.254: v52.77,37.27 56.71,37.27 JP2.21
GPIO10  (via drill 0.3)
  Top 0.254: J1.44 52.46,38.19 52.77,37.88 v52.83,37.88
  Bottom 0.254: v52.83,37.88 56.67,37.88 60.26,34.29 JP2.19
GPIO11  (via drill 0.3)
  Top 0.254: J1.38 52.19,36.99 52.44,36.73 52.61,36.73 v52.7,36.64
  Bottom 0.254: v52.7,36.64 56.8,36.64 60.99,32.45 60.99,30.45 JP2.23
GPIO12
  Top 0.254: J1.31 56.03,35.79 59.34,32.48 59.34,27.62 61.56,25.4 62.96,25.4 63.5,24.86 63.5,20.32 JP2.32
GPIO13  (via drill 0.3)
  Top 0.254: v53.53,33.91 53.31,34.13 52.89,34.13 52.03,34.99 J1.28
  Bottom 0.254: v53.53,33.91 57.38,33.91 59.44,31.85 59.44,19.3 JP2.33
GPIO14
  Top 0.254: J1.55 55.67,40.59 60.96,45.88 60.96,47.66 61.59,48.29 63.53,48.29 JP2.8
GPIO15
  Top 0.254: J1.51 58.97,39.79 60.55,41.37 60.55,44.7 61.59,45.75 63.53,45.75 JP2.10
GPIO16
  Top 0.254: J1.29 55.9,35.39 58.96,32.32 58.96,22.86 61.5,20.32 62.96,20.32 63.5,19.78 63.5,15.24 JP2.36
GPIO17  (via drill 0.3)
  Top 0.254: v53.47,39.86 53.37,39.76 53.3,39.76 52.93,39.39 J1.50
  Bottom 0.254: v53.47,39.86 59.64,39.86 60.96,41.18 60.96,43.18 JP2.11
GPIO18
  Top 0.254: J1.49 59.1,39.39 60.93,41.21 60.93,42.58 61.53,43.18 63.53,43.18 64.77,44.42 JP2.12
GPIO19  (via drill 0.3)
  Top 0.254: J1.26 51.89,34.59 52.73,33.75 52.99,33.75 v53.5,33.24
  Bottom 0.254: v53.5,33.24 57.51,33.24 59.05,31.69 59.05,17.14 JP2.35
GPIO20
  Top 0.254: J1.27 55.76,34.99 58.58,32.16 58.58,18.26 61.59,15.24 62.96,15.24 63.5,14.7 63.5,12.7 JP2.38
GPIO21
  Top 0.254: J1.25 55.62,34.59 58.2,32.01 58.2,13.56 61.59,10.16 63.09,10.16 63.12,10.19 63.47,10.19 JP2.40
GPIO22  (via drill 0.3)
  Top 0.254: J1.46 53.51,38.59 v53.53,38.61
  Bottom 0.254: v53.53,38.61 61.47,38.61 JP2.15
GPIO23
  Top 0.254: J1.47 59.91,38.99 61.56,40.64 63.5,40.64 JP2.16
GPIO24
  Top 0.254: J1.45 61.11,38.59 61.56,38.13 63.47,38.13 JP2.18
GPIO25
  Top 0.254: J1.41 57.3,37.79 59.53,35.56 62.96,35.56 63.47,35.05 63.47,33.05 JP2.22
GPIO26  (via drill 0.3)
  Top 0.254: J1.24 51.75,34.19 53.18,32.76 53.4,32.76 v53.5,32.66
  Bottom 0.254: v53.5,32.66 57.55,32.66 58.67,31.53 58.67,14.99 JP2.37
GPIO27  (via drill 0.3)
  Top 0.254: J1.48 53.21,38.99 v53.5,39.27
  Bottom 0.254: v53.5,39.27 59.59,39.27 JP2.13
HDMI0_CK_N
  Top 0.152: J2.90 16.66,47.39 16.6,47.33 15.75,47.33 15.72,47.35 14.28,47.35 11.88,49.75 HDMI.12
HDMI0_CK_P
  Top 0.152: J2.88 16.66,46.99 16.6,47.05 15.54,47.05 15.51,47.07 14.16,47.07 12.36,48.87 12.12,48.87 12,48.75 HDMI.10
HDMI0_D0_N
  Top 0.152: HDMI.9 11.92,48.25 14.04,46.14 16.27,46.14 16.32,46.19 J2.84
HDMI0_D0_P
  Top 0.152: HDMI.7 12.04,47.25 12.15,47.36 12.38,47.36 13.91,45.84 16.04,45.84 16.09,45.79 J2.82
HDMI0_D1_N
  Top 0.152: HDMI.6 11.92,46.75 13.73,44.94 16.27,44.94 16.32,44.99 J2.78
HDMI0_D1_P
  Top 0.152: HDMI.4 12.04,45.75 12.15,45.86 12.38,45.86 13.61,44.63 16.04,44.63 16.09,44.59 J2.76
HDMI0_D2_N
  Top 0.152: J2.72 16.4,43.79 16.35,43.74 13.76,43.74 12.59,44.9 12.37,44.9 12.02,45.25 HDMI.3
HDMI0_D2_P
  Top 0.152: J2.70 16.41,43.39 16.36,43.43 13.63,43.43 12.59,44.48 12.48,44.48 12.25,44.25 HDMI.1
HDMI0_HOTPLUG
  Top 0.203: HDMI.19 19.9,53.25 22.68,50.47 22.68,41.1 21.77,40.19 J2.53
HDMI0_SCL
  Top 0.152: HDMI.15 13.47,51.25 15.33,49.39 J2.100
HDMI0_SDA
  Top 0.152: HDMI.16 18.03,51.75 J2.99
ID_SC
  Top 0.254: J1.35 56.89,36.59 60.58,32.89 60.58,28.92 61.56,27.94 62.9,27.94 63.53,27.3 63.53,25.37 JP2.28
ID_SD  (via drill 0.3)
  Top 0.254: J1.36 52.05,36.59 52.48,36.16 52.8,36.16 v53.09,35.88
  Bottom 0.254: v53.09,35.88 57.02,35.88 60.58,32.32 60.58,25.78 JP2.27
N$1
  Top 0.254: R2.2 12.7,59.62 12.7,61.69 ACT.C
N$8
  Top 0.254: R1.2 14.86,60.71 15.24,61.09 15.24,64.64 15.11,64.77 PWR.A
N$14
  Top 0.254: R6.2 10.42,27.3 9.53,28.2 9.53,33.27 9.14,33.66 7.75,33.66 USB-C.A5
N$15
  Top 0.254: USB-C.B5 8.86,30.64 9.14,30.35 9.14,26.29 10.16,25.27 R7.1
N$16
  Top 0.254: R1.1 7.74,60.71 7.14,60.1 7.14,40.93 8.41,39.66 12.32,39.66 12.7,39.27 12.7,37.62 13,37.32 IC.4
N_PWR_LED  (via drill 0.3)
  Top 0.254: IC.2 10.86,37.97 v10.83,37.94 | J1.95 53.11,48.59 52.99,48.47 v52.99,48.42
  Bottom 0.254: v10.83,37.94 11.62,37.15 31.5,37.15 42.77,48.42 v52.99,48.42
N_RPIBOOT  (via drill 0.3)
  Top 0.254: BOOT.1 BOOT.2 65.91,5.71 68.14,7.94 68.14,32.65 v67.99,32.8 | v68.04,38.07 68.04,50.29 67.47,50.86 61.69,50.86 60.99,50.16 60.99,48.83 60.35,48.19 J1.93
  Bottom 0.254: v67.99,32.8 68.04,32.85 v68.04,38.07
PI_NLED_ACTVITY  (via drill 0.3)
  Top 0.254: R2.1 11.75,56.58 13.46,54.86 26.92,54.86 | J1.21 55.88,33.79 57.67,32 v57.67,30.43 | v40.26,30.45 40.26,54.16 39.56,54.86
  Top 0.305: 26.92,54.86 39.56,54.86
  Bottom 0.254: v57.67,30.43 40.28,30.43 v40.26,30.45
SCL0  (via drill 0.3)
  Top 0.254: CAMERA.13 43.1,43.86 v44.48,45.24 | J1.80 49.61,45.39 v49.53,45.31
  Bottom 0.254: v44.48,45.24 49.47,45.24 v49.53,45.31
SD_CLK  (via drill 0.3)
  Top 0.254: v10.41,31.37 10.44,31.39 R4.1 | J1.57 53.78,40.99 v53.66,40.86
  Bottom 0.254: v10.41,31.37 12.54,29.25 SD_CARD.CLK 25.75,29.24 37.37,40.86 v53.66,40.86
SD_CMD  (via drill 0.3)
  Top 0.254: v10.41,33.4 10.44,33.43 R3.1 | v50.39,41.78 v50.39,41.79 J1.62
  Bottom 0.254: v10.41,33.4 12.37,31.45 SD_CARD.CMD 27.41,31.45 37.85,41.88 50.29,41.88 v50.39,41.78
SD_DAT0  (via drill 0.3)
  Top 0.254: v10.41,29.34 10.44,29.36 R5.1 | v48.9,40.38 48.9,42.36 v49.28,42.74 | J1.63 53.92,42.19 53.5,42.61 52.75,42.61 v52.48,42.87
  Bottom 0.254: v10.41,29.34 12.71,27.05 SD_CARD.DAT0 24.09,27.05 37.53,40.48 48.8,40.48 v48.9,40.38 | v52.48,42.87 52.23,42.87 52,42.64 49.38,42.64 v49.28,42.74
SD_DAT1  (via drill 0.3)
  Top 0.254: v48.9,39.78 48.61,39.78 48.39,40 48.39,42.58 v49.21,43.4 | J1.67 53.22,42.99 52.93,43.27 52.79,43.27 52.68,43.38 v52.19,43.38
  Bottom 0.254: SD_CARD.DAT1 23.53,25.95 37.36,39.78 v48.9,39.78 | v49.21,43.4 49.39,43.22 52.03,43.22 v52.19,43.38
SD_DAT2  (via drill 0.3)
  Top 0.254: J1.69 54.38,43.37 53.37,43.37 v52.99,43.75
  Bottom 0.254: SD_CARD.DAT2 28.58,33.7 38.8,43.91 52.83,43.91 v52.99,43.75
SD_DAT3  (via drill 0.3)
  Top 0.254: J1.61 53.78,41.79 53.37,42.2 52.42,42.2 v52.32,42.29
  Bottom 0.254: SD_CARD.CD/DAT3 27.97,32.55 37.69,42.26 52.3,42.26 v52.32,42.29
SDA0
  Top 0.254: CAMERA.14 44.1,42.64 47.25,45.79 J1.82
USB2_N
  Top 0.254: J2.3 19.33,30.19 18.92,29.78 18.92,18.76 16.3,16.14 USB-A.D-
USB2_P
  Top 0.254: J2.5 21.2,30.59 21.37,30.42 21.37,20.32 21.37,19.59 15.91,14.14 USB-A.D+

### Text on the board
tPlace: GPIO2 | GPIO3 | GPIO4 | GPIO14 | GPIO15 | GPIO17 | GPIO18 | GPIO27 | GPIO22 | GPIO23 | GPIO24 | GPIO10 | GPIO9 | GPIO25 | GPIO11 | GPIO8 | GPIO7 | GPIO0 | GPIO1 | GPIO5 | GPIO6 | GPIO12 | GPIO13 | GPIO19 | GPIO16 | GPIO26 | GPIO20 | GPIO21 | Hold BOOT button / during start to / force USB boot / mode (CM4 / versions with / eMMC only) | E
bPlace: Minimal RPi CM4 Carrier board | design based on Prof. Fartsparkle´s | Minimal Raspberry Pi CM 4 Carrier | This board was designed by | This board was designed by | www.czechmaker.com